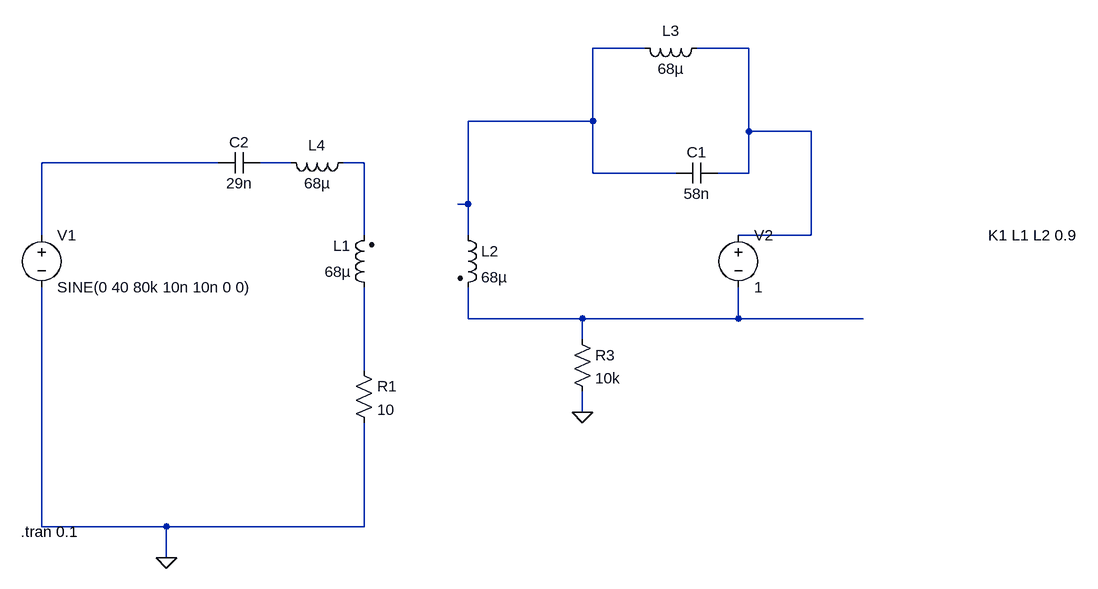
[diagram p0: schematic saturable_inductor - Copy.asc]
saturable_inductor - Copy.asc, the LTspice schematic file:
Version 4
SHEET 1 1396 708
WIRE 720 -192 640 -192
WIRE 880 -192 800 -192
WIRE 640 -80 640 -192
WIRE 640 -80 448 -80
WIRE 880 -64 880 -192
WIRE 976 -64 880 -64
WIRE 64 -16 -208 -16
WIRE 176 -16 128 -16
WIRE 288 -16 256 -16
WIRE 640 0 640 -80
WIRE 768 0 640 0
WIRE 880 0 880 -64
WIRE 880 0 832 0
WIRE 448 48 448 -80
WIRE 448 48 432 48
WIRE -208 96 -208 -16
WIRE 288 96 288 -16
WIRE 448 96 448 48
WIRE 976 96 976 -64
WIRE 976 96 864 96
WIRE 448 224 448 176
WIRE 624 224 448 224
WIRE 864 224 864 176
WIRE 864 224 624 224
WIRE 1056 224 864 224
WIRE 624 256 624 224
WIRE 288 304 288 176
WIRE 624 368 624 336
WIRE -208 544 -208 176
WIRE -16 544 -208 544
WIRE 288 544 288 384
WIRE 288 544 -16 544
WIRE -16 592 -16 544
FLAG -16 592 0
FLAG 624 368 0
SYMBOL ind2 304 192 R180
WINDOW 0 36 80 Left 2
WINDOW 3 36 40 Left 2
SYMATTR InstName L1
SYMATTR Value 68µ
SYMATTR Type ind
SYMBOL ind2 432 80 R0
SYMATTR InstName L2
SYMATTR Value 68µ
SYMATTR Type ind
SYMATTR SpiceLine Rser=0.5
SYMBOL voltage -208 80 R0
WINDOW 123 0 0 Left 0
WINDOW 39 0 0 Left 0
SYMATTR InstName V1
SYMATTR Value SINE(0 40 80k 10n 10n 0 0)
SYMBOL res 272 288 R0
SYMATTR InstName R1
SYMATTR Value 10
SYMBOL res 608 240 R0
SYMATTR InstName R3
SYMATTR Value 10k
SYMBOL voltage 864 80 R0
WINDOW 123 0 0 Left 0
WINDOW 39 0 0 Left 0
SYMATTR InstName V2
SYMATTR Value 1
SYMBOL ind 816 -208 R90
WINDOW 0 5 56 VBottom 2
WINDOW 3 32 56 VTop 2
SYMATTR InstName L3
SYMATTR Value 68µ
SYMBOL cap 832 -16 R90
WINDOW 0 0 32 VBottom 2
WINDOW 3 32 32 VTop 2
SYMATTR InstName C1
SYMATTR Value 58n
SYMBOL cap 128 -32 R90
WINDOW 0 0 32 VBottom 2
WINDOW 3 32 32 VTop 2
SYMATTR InstName C2
SYMATTR Value 29n
SYMBOL ind 272 -32 R90
WINDOW 0 5 56 VBottom 2
WINDOW 3 32 56 VTop 2
SYMATTR InstName L4
SYMATTR Value 68µ
TEXT 1248 96 Left 2 !K1 L1 L2 0.9
TEXT -240 552 Left 2 !.tran 0.1

The netlist it stands for:
* saturable_inductor - Copy.asc
L1 N007 N005 68µ
L2 N001 N006 68µ Rser=0.5
V1 N003 0 SINE(0 40 80k 10n 10n 0 0)
R1 N007 0 10
R3 N006 0 10k
V2 N002 N006 1
L3 N002 N001 68µ
C1 N002 N001 58n
C2 N004 N003 29n
L4 N005 N004 68µ
K1 L1 L2 0.9
.tran 0.1
.backanno
.end